# Altium schematic sheet TOP.SchDoc
size A3; SheetNumber: 2; SheetTotal: 5
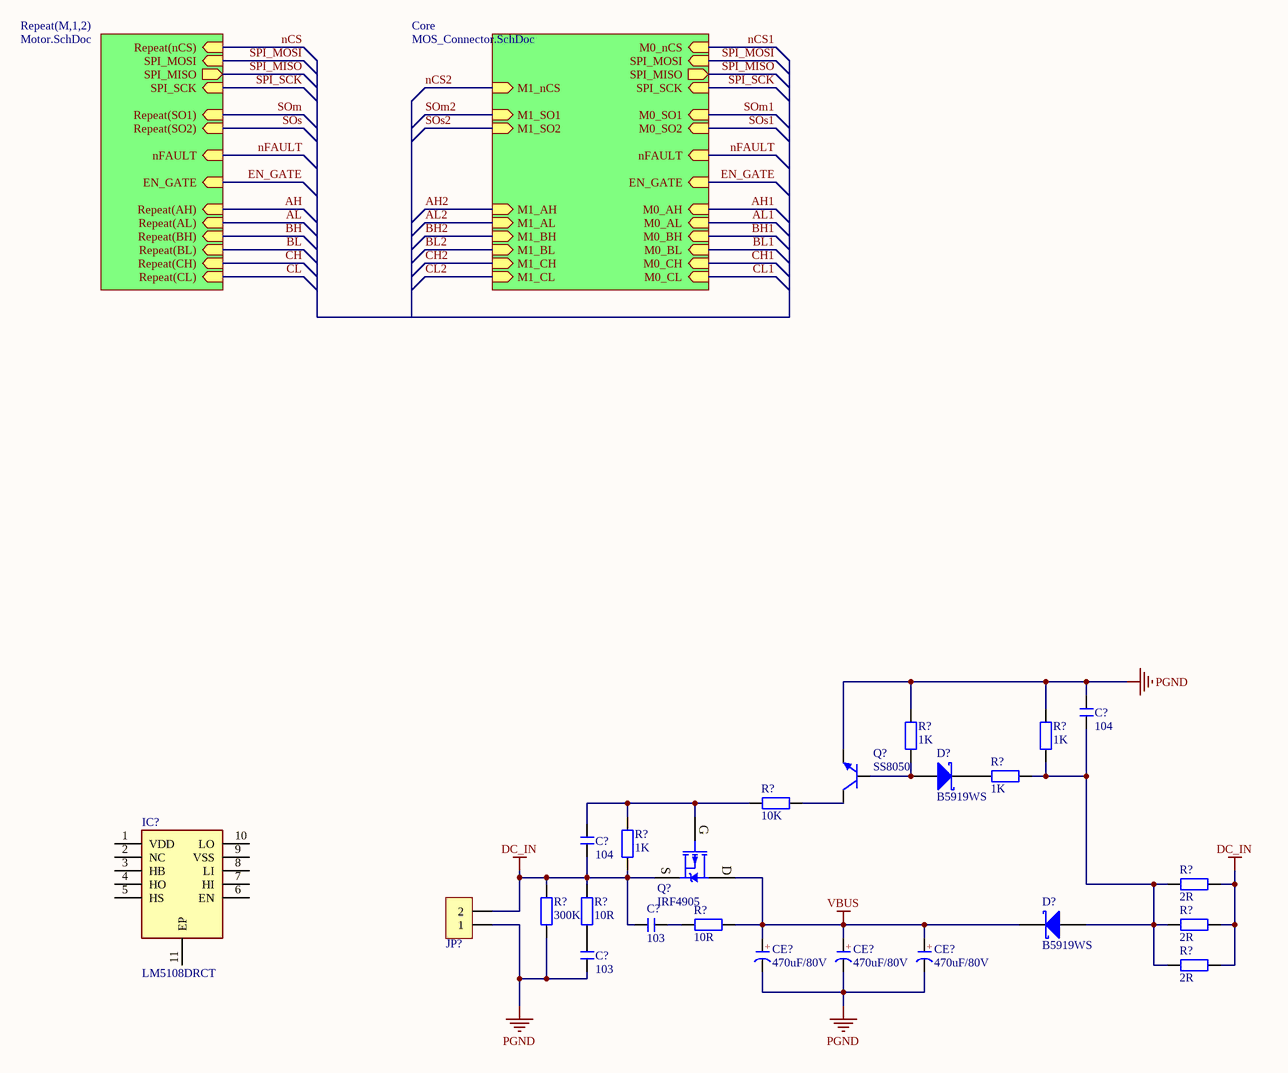
[diagram p0: TOP.SchDoc]

## Parts
(Parts that share a designator on the sheet are numbered #1, #2 ... from top to bottom, then left to right.)
C?#1  104  [C 0805_L]
C?#2  104  [C 0805_L]
C?#3  103  [C 0805_L]
C?#4  103  [C 0805_L]
CE?#1  470uF/80V  [CAP 1.5*4*8]
CE?#2  470uF/80V  [CAP 1.5*4*8]
CE?#3  470uF/80V  [CAP 1.5*4*8]
D?#1  B5919WS  [SOD-323]
D?#2  B5919WS  [SOD-323]
IC?  LM5108DRCT  [SON50P300X300X100-11N-D]
JP?  HDR-1X2  [XH2.54-WI-2P]  (value not drawn)
Q?#1  SS8050  [SOT23-3N]
Q?#2  IRF4905  [TO220A]
R?#1  1K  [R 0805_L]
R?#2  1K  [R 0805_L]
R?#3  1K  [R 0805_L]
R?#4  10K  [R 0805_L]
R?#5  1K  [R 0805_L]
R?#6  300K  [R 0805_L]
R?#7  10R  [R 0805_L]
R?#8  2R  [RX10-18*15*5]
R?#9  10R  [R 0805_L]
R?#10  2R  [RX10-18*15*5]
R?#11  2R  [RX10-18*15*5]

## Sub-sheets
Core = MOS_Connector.SchDoc: M0_nCS (in), SPI_MOSI (in), SPI_MISO (out), SPI_SCK (in), M0_SO1 (in), M0_SO2 (in), nFAULT (in), M0_CH (in), M0_CL (in), M0_AH (in), M0_AL (in), M0_BH (in), M0_BL (in), EN_GATE (in), M1_CH (in), M1_CL (in), M1_AH (in), M1_AL (in), M1_BH (in), M1_BL (in), M1_SO1 (in), M1_SO2 (in), M1_nCS (in)
Repeat(M,1,2) = Motor.SchDoc: Repeat(nCS) (in), SPI_MOSI (in), SPI_MISO (out), SPI_SCK (in), Repeat(SO1) (in), Repeat(SO2) (in), nFAULT (in), Repeat(CH) (in), Repeat(CL) (in), Repeat(AH) (in), Repeat(AL) (in), Repeat(BH) (in), Repeat(BL) (in), EN_GATE (in)

## Nets
DC_IN: C?#2.1 C?#3.2 JP?.2 Q?#2.3(S) R?#5.1 R?#6.1 R?#7.1 R?#8.1 R?#10.1 R?#11.1
PGND: C?#1.1 C?#4.2 CE?#1.2(K) CE?#2.2(K) CE?#3.2(K) JP?.1 Q?#1.2(E) R?#1.1 R?#2.2 R?#6.2
VBUS: CE?#1.1(A) CE?#2.1(A) CE?#3.1(A) D?#2.2(K) Q?#2.2(D) R?#9.1
AH: sheet Repeat(M,1,2)/Repeat(AH)
AH1: sheet Core/M0_AH
AH2: sheet Core/M1_AH
AL: sheet Repeat(M,1,2)/Repeat(AL)
AL1: sheet Core/M0_AL
AL2: sheet Core/M1_AL
BH: sheet Repeat(M,1,2)/Repeat(BH)
BH1: sheet Core/M0_BH
BH2: sheet Core/M1_BH
BL: sheet Repeat(M,1,2)/Repeat(BL)
BL1: sheet Core/M0_BL
BL2: sheet Core/M1_BL
CH: sheet Repeat(M,1,2)/Repeat(CH)
CH1: sheet Core/M0_CH
CH2: sheet Core/M1_CH
CL: sheet Repeat(M,1,2)/Repeat(CL)
CL1: sheet Core/M0_CL
CL2: sheet Core/M1_CL
EN_GATE: sheet Repeat(M,1,2)/EN_GATE, sheet Core/EN_GATE
nCS: sheet Repeat(M,1,2)/Repeat(nCS)
nCS1: sheet Core/M0_nCS
nCS2: sheet Core/M1_nCS
nFAULT: sheet Repeat(M,1,2)/nFAULT, sheet Core/nFAULT
SOm: sheet Repeat(M,1,2)/Repeat(SO1)
SOm1: sheet Core/M0_SO1
SOm2: sheet Core/M1_SO1
SOs: sheet Repeat(M,1,2)/Repeat(SO2)
SOs1: sheet Core/M0_SO2
SOs2: sheet Core/M1_SO2
SPI_MISO: sheet Repeat(M,1,2)/SPI_MISO, sheet Core/SPI_MISO
SPI_MOSI: sheet Repeat(M,1,2)/SPI_MOSI, sheet Core/SPI_MOSI
SPI_SCK: sheet Repeat(M,1,2)/SPI_SCK, sheet Core/SPI_SCK
NetC?#1_2: C?#1.2 D?#2.1(A) R?#2.1 R?#3.2 R?#8.2 R?#10.2 R?#11.2
NetC?#2_2: C?#2.2 Q?#2.1(G) R?#4.1 R?#5.2
NetC?#3_1: C?#3.1 R?#9.2
NetC?#4_1: C?#4.1 R?#7.2
NetD?#1_1: D?#1.1(A) Q?#1.1(B) R?#1.2
NetD?#1_2: D?#1.2(K) R?#3.1
NetQ?#1_3: Q?#1.3(C) R?#4.2

Not connected (* = marked no-connect by the designer): IC? 1(VDD) 2(NC) 3(HB) 4(HO) 5(HS) 6(EN) 7(HI) 8(LI) 9(VSS) 10(LO) 11(EP)

## Notes on the sheet
- (in symbol CE) +

## Library data of the parts
C?#1-C?#4 = C: 贴片电容; BOM名称: 无极性贴片电容; 淘宝ID: 封装库来自淘宝 ID：黄晶宝石; 联系售后，技术支持: https://shop463601444.taobao.com; 唯一出售店铺网址: https://shop463601444.taobao.com
CE?#1-CE?#3 = CE: 直插电解电容; 淘宝ID: 封装库来自淘宝 ID：黄晶宝石; BOM名称: 直插电解电容; 联系售后: https://shop463601444.taobao.com
D?#1 D?#2 = 1N5819: 肖特基二极管; 淘宝ID: 封装库来自淘宝 ID：黄晶宝石; 属性: 40V/2A; BOM名称: 肖特基二极管; 欢迎光临: https://shop463601444.taobao.com
IC? = LM5108DRCT: Integrated Circuit; Manufacturer_Name: Texas Instruments; Description: Robust and compact 100-V half-bridge driver; Datasheet Link: http://www.ti.com/lit/gpn/LM5108; Height: 1mm; Manufacturer_Part_Number: LM5108DRCT; Mouser Part Number: 595-LM5108DRCT; Mouser Price/Stock: https://www.mouser.co.uk/ProductDetail/Texas-Instruments/LM5108DRCT?qs=T3oQrply3y%2FzIxTRQrXrXQ%3D%3D; Arrow Part Number: LM5108DRCT; Arrow Price/Stock: https://www.arrow.com/en/products/lm5108drct/texas-instruments?region=nac
JP? = Header 2: 2P接插件; 版权归属: 封装库来自淘宝 ID：黄晶宝石; BOM名称: 2P接插件; 联系售后: https://shop463601444.taobao.com
Q?#1 = 8050-SMD: 高频放大-NPN型; 版权归属: 封装库来自淘宝 ID：黄晶宝石; 属性: 40V 1.5A 1W 100MHZ; BOM名称: 高频放大-NPN型; 联系售后: https://shop463601444.taobao.com
Q?#2 = IRF4905: P沟场效应管; 版权归属: 封装库来自淘宝卖家 ID：黄晶宝石; BOM名称: P沟场效应管; 技术支持，联系售后: https://shop463601444.taobao.com
R?#1-R?#7 R?#9 = R: 贴片电阻; 版权归属: 来自淘宝 ID：黄晶宝石; 封装库来自淘宝卖家 ID：黄晶宝石: 其他店铺购入均为盗版，不享受售后技术支持服务，请立即申请退款; BOM名称: 贴片电阻; 联系售后: https://shop463601444.taobao.com
R?#8 R?#10 R?#11 = R_MPR: 5W无感水泥电阻; BOM名称: 大功率电阻; 版权归属: 封装库来自淘宝 ID：黄晶宝石; 联系售后: https://shop463601444.taobao.com